# Altium schematic sheet Sheet1.SchDoc
size A4
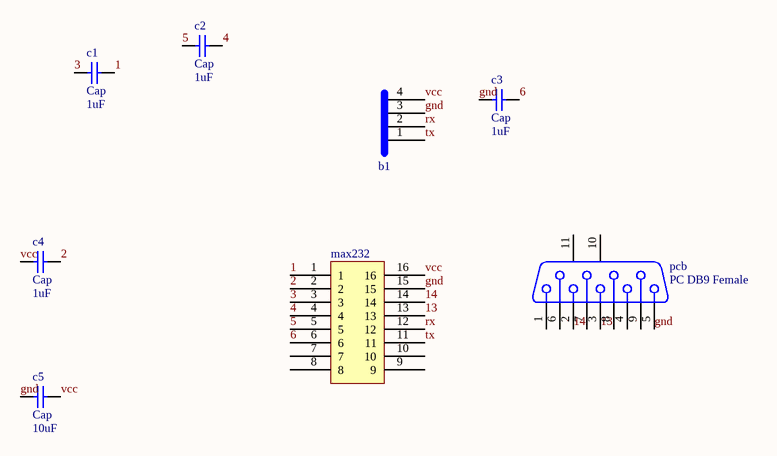
[diagram p0: Sheet1.SchDoc]

## Parts
?  b1  [bergstrip-4pin]
c1  Cap  value 1uF  [CAP]
c2  Cap  value 1uF  [CAP]
c3  Cap  value 1uF  [CAP]
c4  Cap  value 1uF  [CAP]
c5  Cap  value 10uF  [CAP]
max232  (no value)  [dip-16pin]
pcb  PC DB9 Female  [DB9 CONNECTOR FEMALE]

## Nets
1: c1.2 max232.1
2: c4.2 max232.2
3: c1.1 max232.3
4: c2.2 max232.4
5: c2.1 max232.5
6: c3.2 max232.6
13: max232.13 pcb.3
14: max232.14 pcb.2
gnd: ?.3 c3.1 c5.1 max232.15 pcb.5
rx: ?.2 max232.12
tx: ?.1 max232.11
vcc: ?.4 c4.1 c5.2 max232.16

Not connected (* = marked no-connect by the designer): max232 7 8 9 10; pcb 1 4 6 7 8 9 10(MH1) 11(MH2)

## Library data of the parts
? = BURG STRIP 4
c1-c5 = Cap: Capacitor; Published: 8-Jun-2000; LatestRevisionDate: 17-Jul-2002; LatestRevisionNote: Re-released for DXP Platform.; PackageReference: RAD-0.3; Publisher: Altium Limited
max232 = dip-16pin
pcb = DB9 CONNECTOR FEMALE